# EAGLE design Pressure (EAGLE 6.5.0)
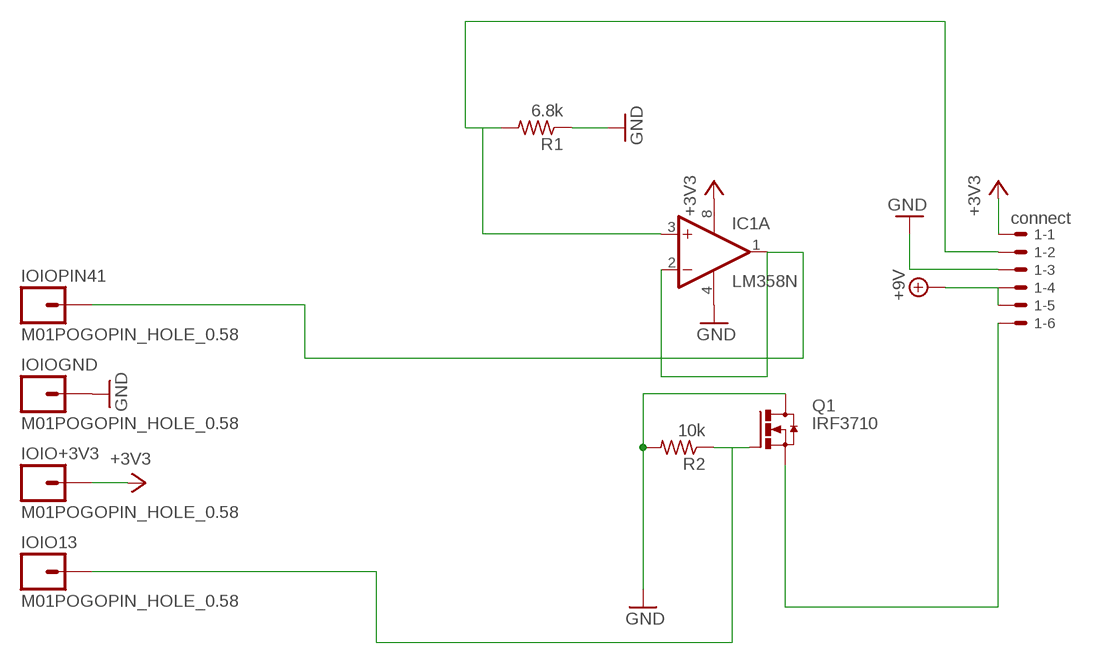
[diagram p0: schematic, sheet 1]

## Parts
1  connect  C-GRID-06-70543  [70543-06]
IC1  LM358N  [DIL08]
IOIO13  M01POGOPIN_HOLE_0.58  [1X01_POGOPIN_HOLE_0.58]
IOIO+3V3  M01POGOPIN_HOLE_0.58  [1X01_POGOPIN_HOLE_0.58]
IOIOGND  M01POGOPIN_HOLE_0.58  [1X01_POGOPIN_HOLE_0.58]
IOIOPIN41  M01POGOPIN_HOLE_0.58  [1X01_POGOPIN_HOLE_0.58]
Q1  IRF3710  [TO-220AB]
R1  6.8k  R-US_0204/7  [0204/7]
R2  10k  R-US_0204/7  [0204/7]

## Nets
+3V3: 1.1 IC1.8(P:V+) IOIO+3V3.1
+9V: 1.4 1.5
GND: 1.3 IC1.4(P:V-) IOIOGND.1 Q1.A2(D) R1.1 R2.2
N$1: 1.2 IC1.3(A:+IN) R1.2
N$2: IC1.1(A:OUT) IC1.2(A:-IN) IOIOPIN41.1
N$3: 1.6 Q1.C(S)
N$5: IOIO13.1 Q1.A1(G) R2.1
Unconnected: IC1.5(B:+IN) IC1.6(B:-IN) IC1.7(B:OUT)

## Library data of the parts
1 = con-molex:C-GRID-06: CONNECTOR wire to board 2.54 mm (0.100") pitch header; OC_FARNELL: unknown; OC_NEWARK: unknown
IC1 = linear:LM358: OP AMP also LM158; LM258; LM2904 Source: http://cache.national.com/ds/LM/LM158.pdf
IOIO13 IOIO+3V3 IOIOGND IOIOPIN41 = SparkFun-Connectors:M01: Header 1 Standard 1-pin 0.1" header. Use with straight break away headers (SKU : PRT-00116), right angle break away headers (PRT-00553), swiss pins (PRT-00743), machine pins (PRT-00117), and female headers (PRT-00115).
Q1 = transistor-power:IRF3710: IRF3710 Description Advanced HEXFET® Power MOSFETs from International Rectifier utilize advanced processing techniques to achieve extremely low on-resistance per silicon area. This benefit, combined with the fast switching speed and ruggedized device design that HEXFET power MOSFETs are well known for, provides the designer with an extremely efficient and reliable device for use in a wide variety of applications. The TO-220 package is universally preferred for all commercial-industrial applications at power dissipation levels to approximately 50 watts. The low thermal resistance and low package cost of the TO-220 contribute to its wide acceptance throughout the industry.
R1 R2 = rcl:R-US_: RESISTOR, American symbol

## Board
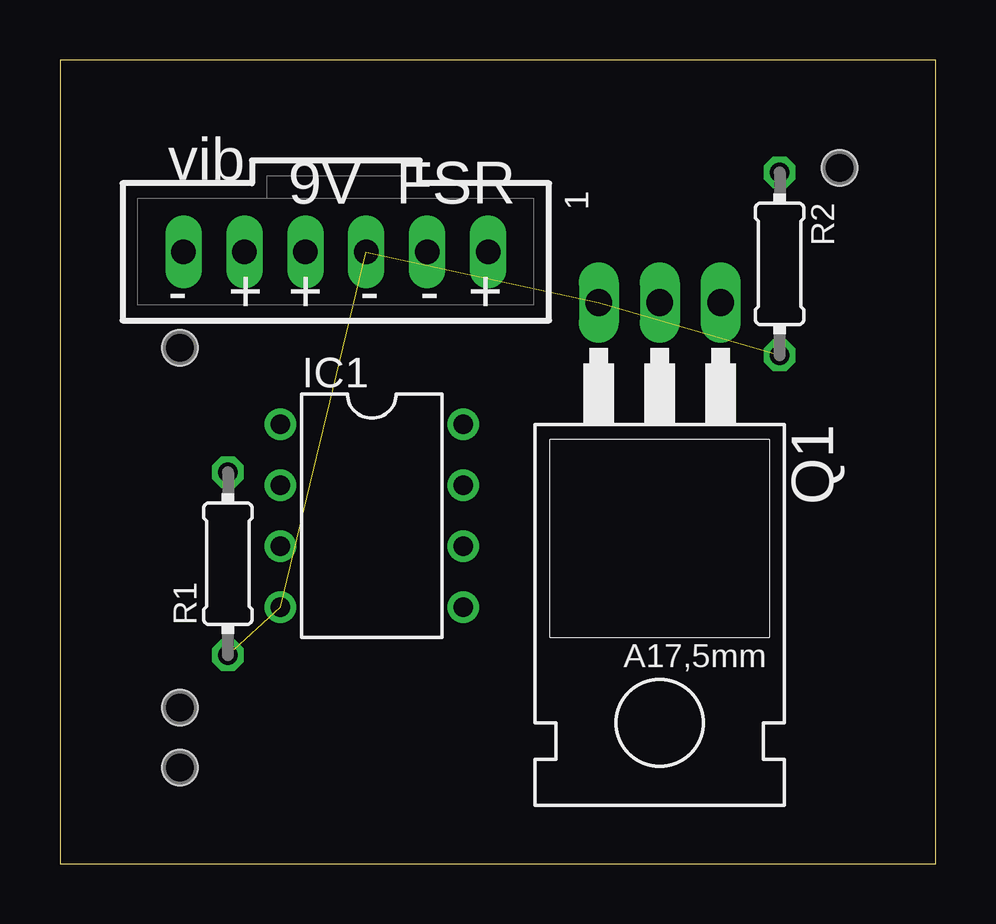
[diagram p1: board, top side]
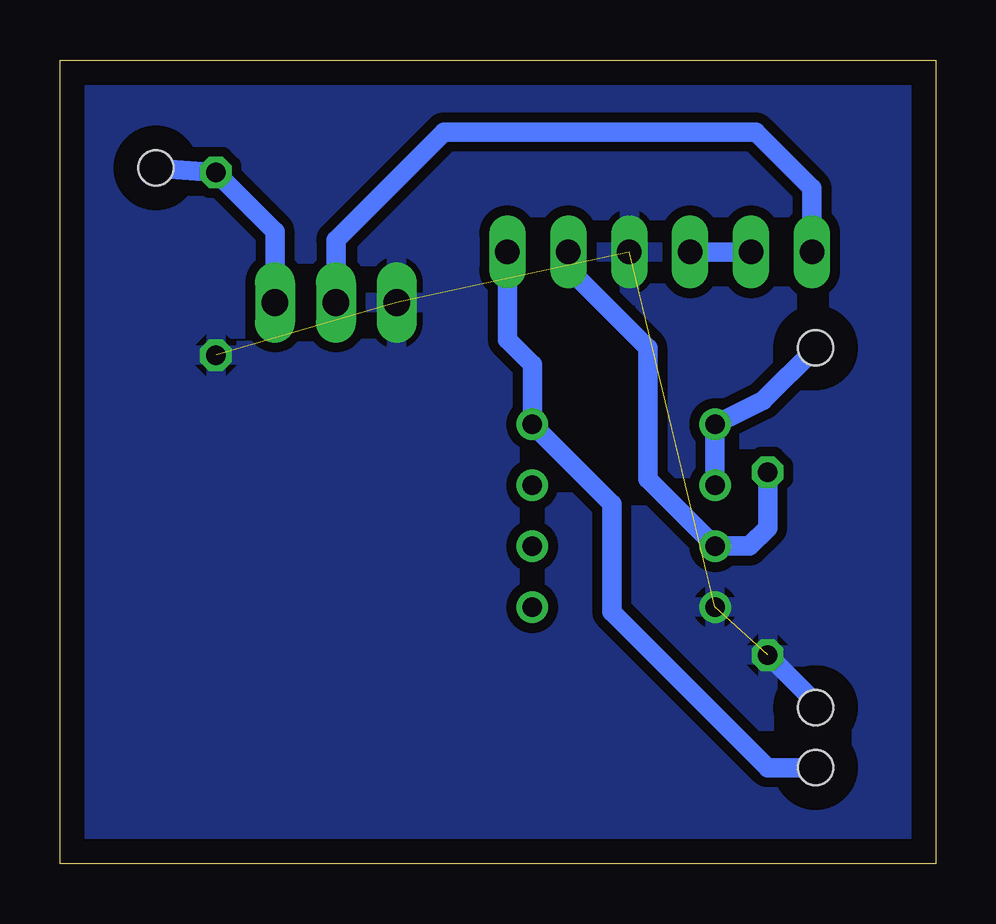
[diagram p2: board, bottom side, seen from below]

Size 36.5 x 33.5 mm. Coordinates in mm from the lower left corner, seen from the top.
Outline: 0,0 36.5,0 36.5,33.5 0,33.5 0,0
Copper layers (1*16): Top 0.035mm / dielectric 1.5mm / Bottom 0.035mm
Design rules "default": minimum track width 10mil, minimum drill 24mil, track to track 8mil, track to pad 8mil, pad to pad 8mil, via to via 8mil, smd to smd 8mil, copper to edge 40mil, drill to drill 8mil, minimum pad ring 10mil, minimum via ring 8mil, stop-mask expansion 4mil, vias tented up to drill 0mil, thermal gap 10mil

### Footprints (pad centres in the part's own frame; a part is rotated, then mirrored left to right if it is on the bottom)
70543-06 = drill 1.016 long: 1 -6.35,0; 2 -3.81,0; 3 -1.27,0; 4 1.27,0; 5 3.81,0; 6 6.35,0
DIL08 = drill 0.813 pad 1.27: 1 -3.81,-3.81; 2 -1.27,-3.81; 3 1.27,-3.81; 4 3.81,-3.81; 5 3.81,3.81; 6 1.27,3.81; 7 -1.27,3.81; 8 -3.81,3.81
1X01_POGOPIN_HOLE_0.58 = drill 0.9 pad 0.813: 1 0,0 | hole 1.473: 0,0
TO-220AB = drill 1.118 long: A1 -2.54,-8.89; A2 2.54,-8.89; C 0,-8.89
0204/7 = drill 0.813 octagon: 1 -3.81,0; 2 3.81,0

### Placement (x,y rotation side)
1  11.5,25.5 180 top
IC1  13,14.5 270 top
IOIO13  32.5,29 0 top
IOIO+3V3  5,4 0 top
IOIOGND  5,6.5 0 top
IOIOPIN41  5,21.5 0 top
Q1  25,14.5 180 top
R1  7,12.5 90 top
R2  30,25 270 top

### Tracks (layer width: path | path; a pad name or v marks a point on that pad's centre or on a via)
+3V3
  Bottom 0.813: IOIO+3V3.1 7,4 13.5,10.5 13.5,15 IC1.8 16.81,20.81 17.85,21.85 1.1
+9V
  Bottom 0.813: 1.5 1.4
GND  (4 unrouted)
  Bottom 0.813: IOIOGND.1 5,6.69 R1.1
  pour Bottom (isolate 0.406): 0,33.5 36.5,33.5 36.5,0 0,0
N$1
  Bottom 0.813: 1.2 15.31,24.81 12,21.5 12,16.04 IC1.3 7.77,13.23 7,14 R1.2
N$2
  Bottom 0.813: IOIOPIN41.1 7.19,19.31 IC1.1 IC1.2
N$3
  Bottom 0.813: 1.6 5.15,28.15 7.5,30.5 20.5,30.5 25,26 Q1.C
N$5
  Bottom 0.813: IOIO13.1 R2.1 27.54,26.35 Q1.A1

### Text on the board
tNames: vib | 9V | FSR | - | + | + | - | - | +